# EasyEDA Pro project 反客H723底板.eprj

# Schematic Schematic1
Create Date: 2023-09-08; Page Name: P1; Project Name: 反客H723底板; Schematic Name: Schematic1; Update Date: 2023-09-17; Company: 嘉立创EDA; Page Size: A4; Version: V1.0
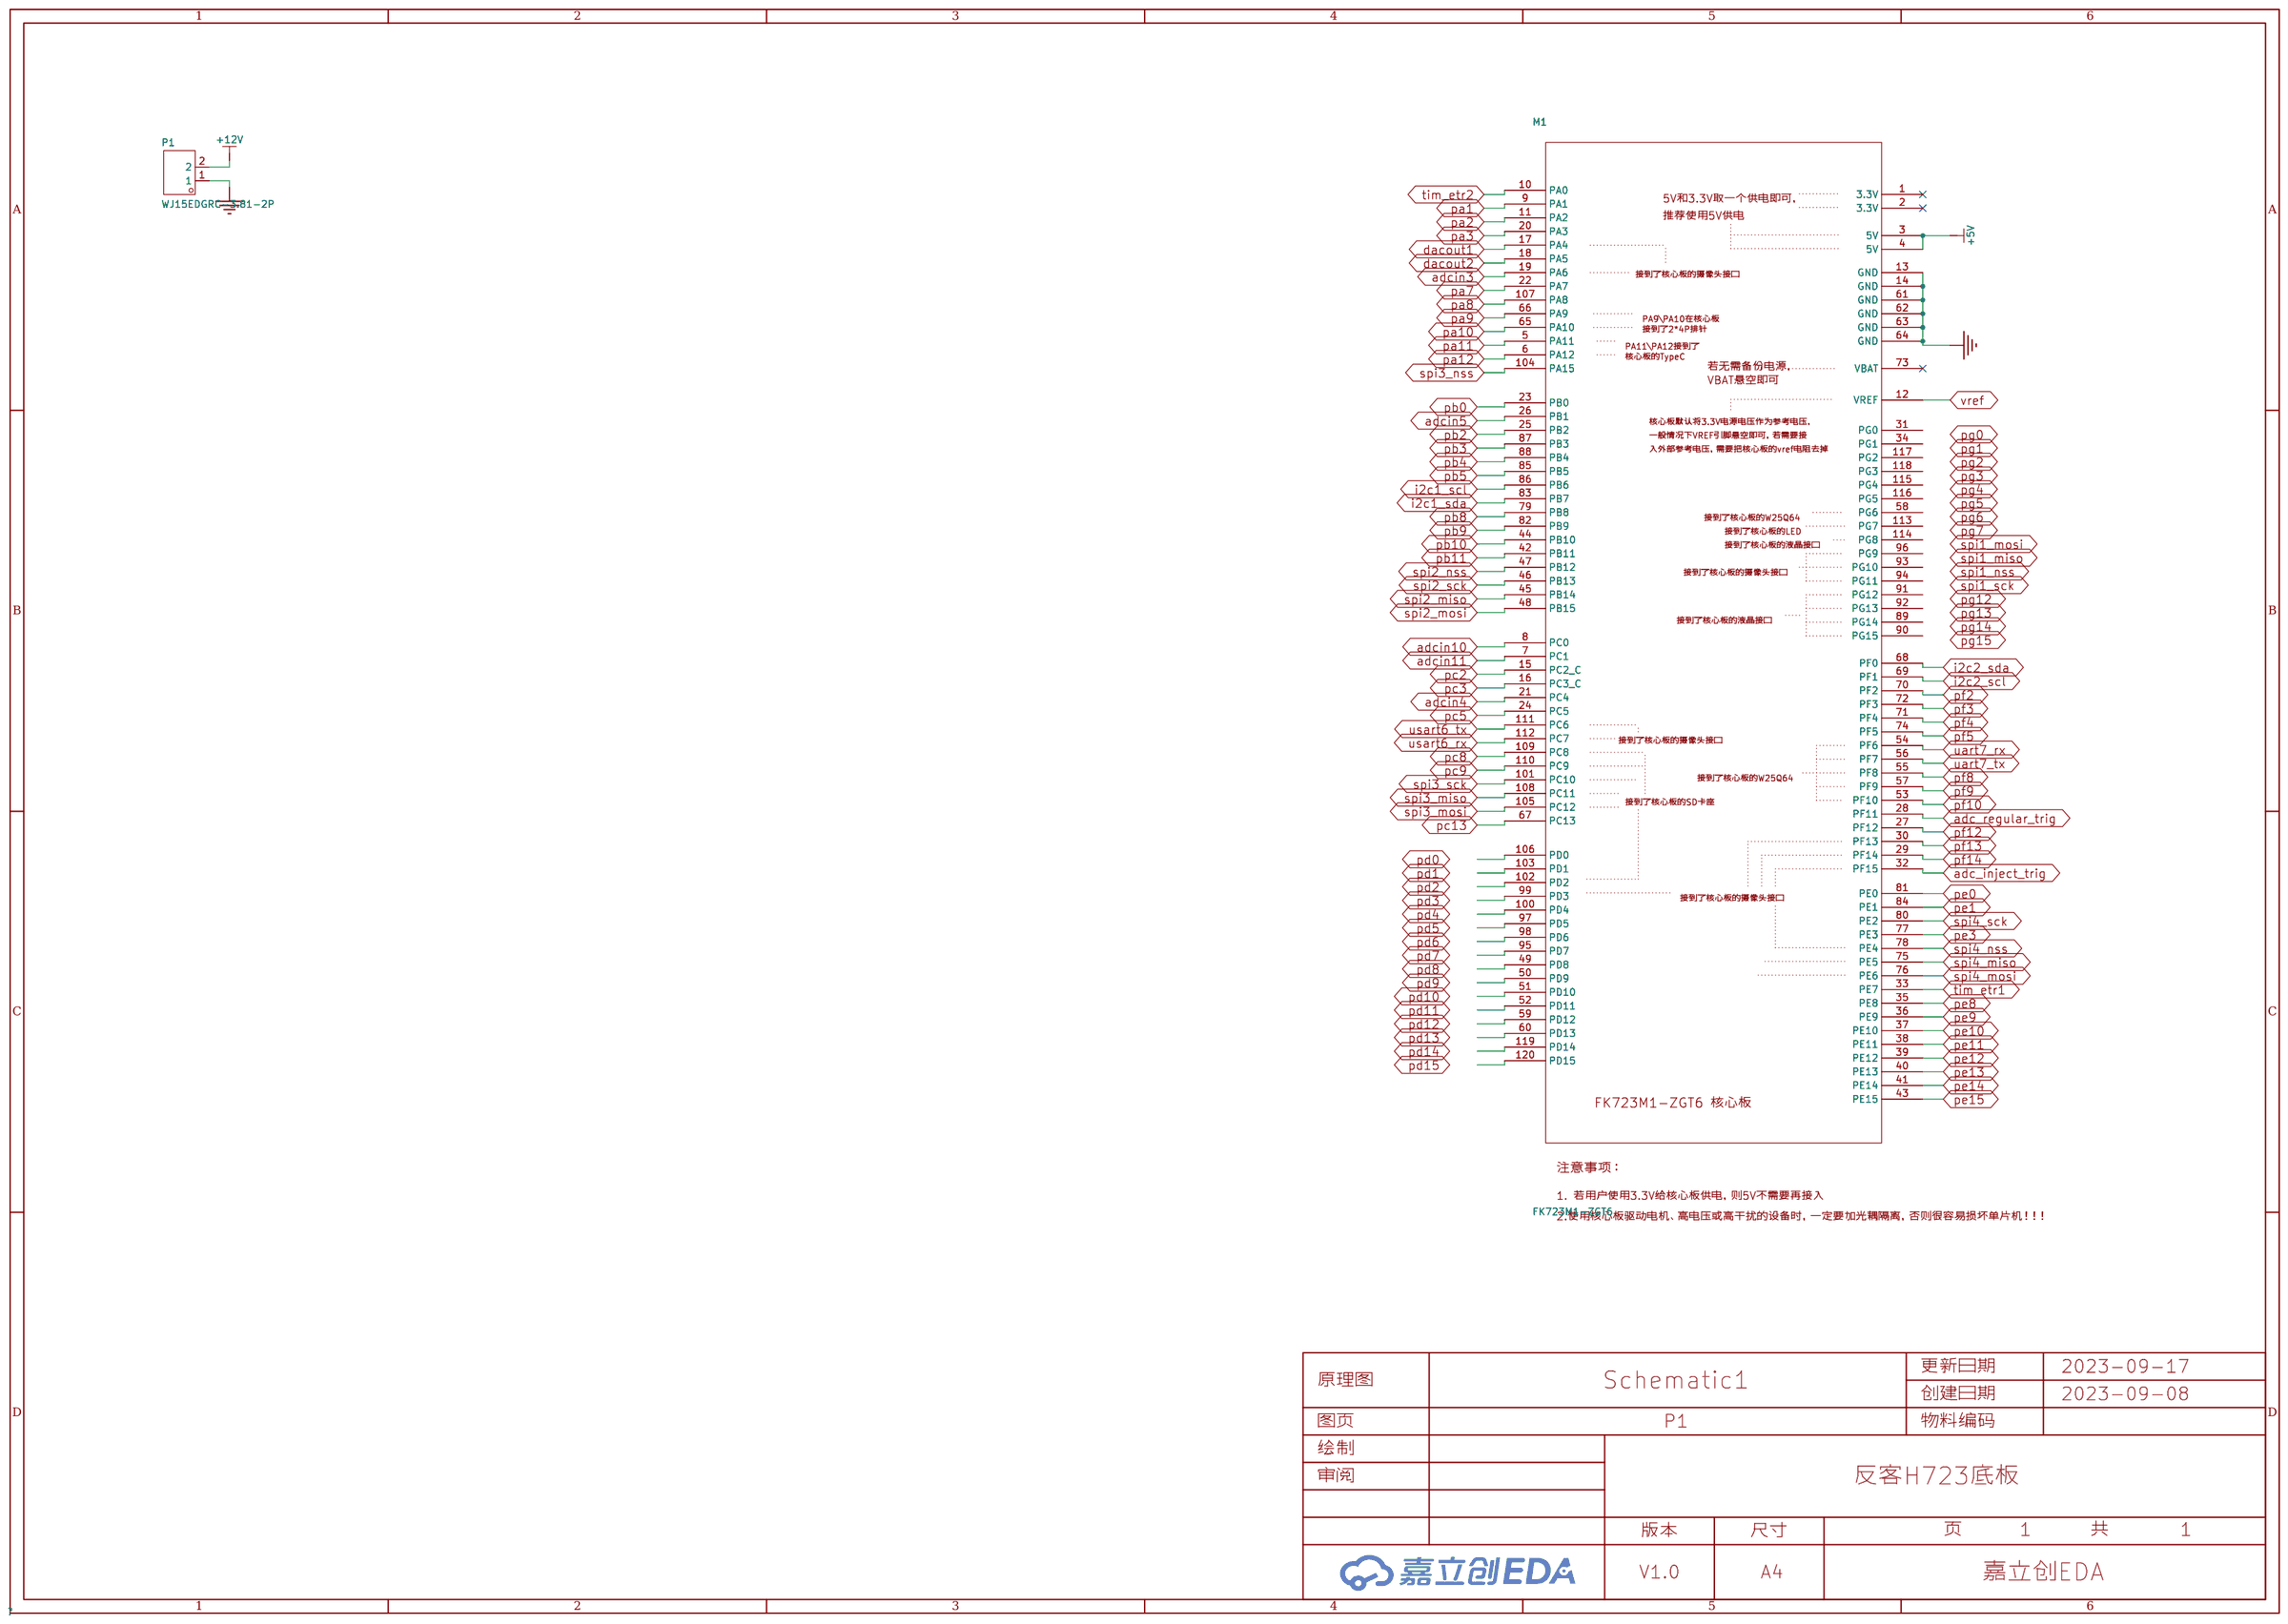
[diagram p0: schematic sheet]

## Parts
M1  FK723M1-ZGT6  [FK723M1-ZGT6]
P1  WJ15EDGRC-3.81-2P  [CONN-TH_2P-P3.81_WJ15EDGRC-3.81-2P]

## Library data of the parts
M1 = FK723M1-ZGT6
P1 = WJ15EDGRC-3.81-2P: 连接器类型:板端/插座-闭口;间距:3.81mm;排数:1;每排PIN数:2;安装方式:弯针;颜色:绿色;; LCSC Part Name: 板端/插座-闭口 3.81mm 排数:1 每排P数:2 弯针; Supplier Part: C8387; Manufacturer: KANGNEX(康奈克斯电气); Supplier Footprint: 弯插,P=3.81mm; JLCPCB Part Class: Extended Part; Datasheet: https://atta.szlcsc.com/upload/public/pdf/source/20191225/C8387_8EBAF10345D2762F0167C8753398EEFA.pdf; Supplier: LCSC; Connector Type: 板端/插座-闭口; Pitch: 3.81mm; Number of Rows: 1; Number of PINs Per Row: 2; Mounting Style: 弯针; Color: 绿色

## Nets
+5V: M1.3(5V) M1.4(5V)
+12V: P1.2
GND: M1.13(GND) M1.14(GND) M1.61(GND) M1.62(GND) M1.63(GND) M1.64(GND) P1.1
adc_inject_trig: M1.32(PF15)
adc_regular_trig: M1.28(PF11)
adcin3: M1.19(PA6)
adcin4: M1.21(PC4)
adcin5: M1.26(PB1)
adcin10: M1.8(PC0)
adcin11: M1.7(PC1)
dacout1: M1.17(PA4)
dacout2: M1.18(PA5)
i2c1_scl: M1.86(PB6)
i2c1_sda: M1.83(PB7)
i2c2_scl: M1.69(PF1)
i2c2_sda: M1.68(PF0)
pa1: M1.9(PA1)
pa2: M1.11(PA2)
pa3: M1.20(PA3)
pa7: M1.22(PA7)
pa8: M1.107(PA8)
pa9: M1.66(PA9)
pa10: M1.65(PA10)
pa11: M1.5(PA11)
pa12: M1.6(PA12)
pb0: M1.23(PB0)
pb2: M1.25(PB2)
pb3: M1.87(PB3)
pb4: M1.88(PB4)
pb5: M1.85(PB5)
pb8: M1.79(PB8)
pb9: M1.82(PB9)
pb10: M1.44(PB10)
pb11: M1.42(PB11)
pc2: M1.15(PC2_C)
pc3: M1.16(PC3_C)
pc5: M1.24(PC5)
pc8: M1.109(PC8)
pc9: M1.110(PC9)
pc13: M1.67(PC13)
pe0: M1.81(PE0)
pe1: M1.84(PE1)
pe3: M1.77(PE3)
pe8: M1.35(PE8)
pe9: M1.36(PE9)
pe10: M1.37(PE10)
pe11: M1.38(PE11)
pe12: M1.39(PE12)
pe13: M1.40(PE13)
pe14: M1.41(PE14)
pe15: M1.43(PE15)
pf2: M1.70(PF2)
pf3: M1.72(PF3)
pf4: M1.71(PF4)
pf5: M1.74(PF5)
pf8: M1.55(PF8)
pf9: M1.57(PF9)
pf10: M1.53(PF10)
pf12: M1.27(PF12)
pf13: M1.30(PF13)
pf14: M1.29(PF14)
spi2_miso: M1.45(PB14)
spi2_mosi: M1.48(PB15)
spi2_nss: M1.47(PB12)
spi2_sck: M1.46(PB13)
spi3_miso: M1.108(PC11)
spi3_mosi: M1.105(PC12)
spi3_nss: M1.104(PA15)
spi3_sck: M1.101(PC10)
spi4_miso: M1.75(PE5)
spi4_mosi: M1.76(PE6)
spi4_nss: M1.78(PE4)
spi4_sck: M1.80(PE2)
tim_etr1: M1.33(PE7)
tim_etr2: M1.10(PA0)
uart7_rx: M1.54(PF6)
uart7_tx: M1.56(PF7)
usart6_rx: M1.112(PC7)
usart6_tx: M1.111(PC6)
vref: M1.12(VREF)

Not connected (* = marked no-connect by the designer): M1 1(3.3V)* 2(3.3V)* 31(PG0) 34(PG1) 49(PD8) 50(PD9) 51(PD10) 52(PD11) 58(PG6) 59(PD12) 60(PD13) 73(VBAT)* 89(PG14) 90(PG15) 91(PG12) 92(PG13) 93(PG10) 94(PG11) 95(PD7) 96(PG9) 97(PD5) 98(PD6) 99(PD3) 100(PD4) 102(PD2) 103(PD1) 106(PD0) 113(PG7) 114(PG8) 115(PG4) 116(PG5) 117(PG2) 118(PG3) 119(PD14) 120(PD15)
